# Altium schematic sheet MAX31865-RTD-SPI.SchDoc: USB-RTD Reader
size A4; Revision: 1.0; SheetNumber: 3; SheetTotal: 3; ProjectName: USB - RTD Reader
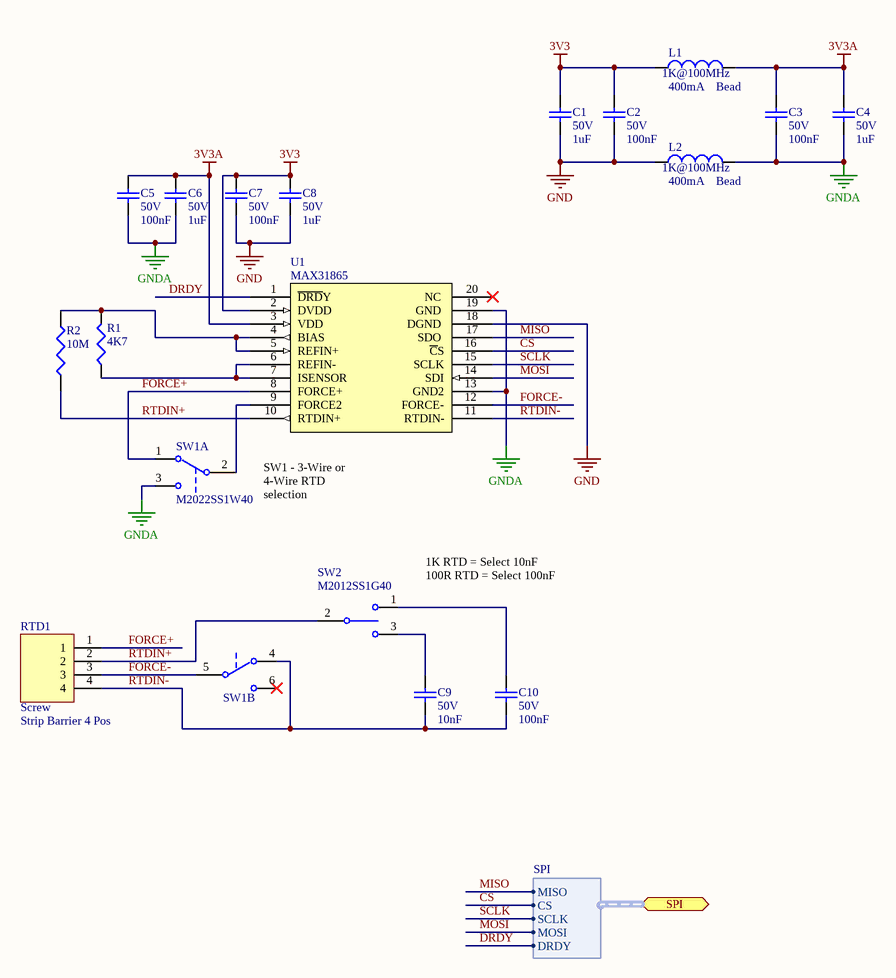
[diagram p0: MAX31865-RTD-SPI.SchDoc]

## Parts
C1  value 1uF  Tensão: 50V  [CC0603]  (hidden comment: Capacitor Cerâmico)
C2  value 100nF  Tensão: 50V  [CC0603]  (hidden comment: Capacitor Cerâmico)
C3  value 100nF  Tensão: 50V  [CC0603]  (hidden comment: Capacitor Cerâmico)
C4  value 1uF  Tensão: 50V  [CC0603]  (hidden comment: Capacitor Cerâmico)
C5  value 100nF  Tensão: 50V  [CC0603]  (hidden comment: Capacitor Cerâmico)
C6  value 1uF  Tensão: 50V  [CC0603]  (hidden comment: Capacitor Cerâmico)
C7  value 100nF  Tensão: 50V  [CC0603]  (hidden comment: Capacitor Cerâmico)
C8  value 1uF  Tensão: 50V  [CC0603]  (hidden comment: Capacitor Cerâmico)
C9  value 10nF  Tensão: 50V  [CC0603]  (hidden comment: Capacitor Cerâmico)
C10  value 100nF  Tensão: 50V  [CC0603]  (hidden comment: Capacitor Cerâmico)
L1  Bead  value 1K@100MHz  Corrente: 400mA  [CC0603]
L2  Bead  value 1K@100MHz  Corrente: 400mA  [CC0603]
R1  value 4K7  [CC0603]  (hidden comment: Resistor)
R2  value 10M  [CC0603]  (hidden comment: Resistor)
RTD1  Screw  value Strip Barrier 4 Pos  [CONN BARRIER STRIP 4CIRC 0.325"]
SW1  M2022SS1W40  [SWITCH TOGGLE DPDT 6A 125V]  (parts A,B of 2)
SW2  M2012SS1G40  [SWITCH TOGGLE SPDT 6A 125V]
U1  MAX31865  [TSSOP-20N]

## Ports
SPI (harness SPI)

## Harnesses
SPI: MISO, CS, SCLK, MOSI, DRDY

## Nets
3V3: C1.2 C2.2 C7.2 C8.2 L1.1 U1.2(DVDD)
3V3A: C3.2 C4.2 C5.2 C6.2 L1.2 U1.3(VDD)
GND: C1.1 C2.1 C7.1 C8.1 L2.1 U1.18(DGND)
GNDA: C3.1 C4.1 C5.1 C6.1 L2.2 SW1.3(NO1) U1.13(GND2) U1.19(GND)
CS: U1.16(~{C}S) ; port SPI.CS
DRDY: U1.1(~{DRD}Y) ; port SPI.DRDY
FORCE+: RTD1.1 SW1.1(NC1) U1.8(FORCE+)
FORCE-: RTD1.3 SW1.5(C2) U1.12(FORCE-)
MISO: U1.17(SDO) ; port SPI.MISO
MOSI: U1.14(SDI) ; port SPI.MOSI
RTDIN+: R2.1 RTD1.2 SW2.2(C1) U1.10(RTDIN+)
RTDIN-: C9.1 C10.1 RTD1.4 SW1.4(NC2) U1.11(RTDIN-)
SCLK: U1.15(SCLK) ; port SPI.SCLK
NetC9_2: C9.2 SW2.3(NO1)
NetC10_2: C10.2 SW2.1(NC1)
NetR1_1: R1.1 U1.6(REFIN-) U1.7(ISENSOR)
NetR1_2: R1.2 R2.2 U1.4(BIAS) U1.5(REFIN+)
NetSW1_2: SW1.2(C1) U1.9(FORCE2)

Not connected (* = marked no-connect by the designer): SW1 6(NO2)*; U1 20(NC)*

## Notes on the sheet
- SW1 - 3-Wire or 4-Wire RTD selection
- (near SW2) 1K RTD = Select 10nF
  100R RTD = Select 100nF
- Projeto:
- Tamanho:
- Data:
- A4
- Eng. Felipe Navarro
- Hora:
- Revisão:
- Folha
- de
- Arquivo:

## Library data of the parts
C1 C4 C6 C8 = Cap 1uF 50V 0603 X5R: Capacitor (Semiconductor SIM Model); Chinês: Local; ChinesePrice: 0,01100; Corrente: *A; Potência: *W; Obs:: X5R; Tolerância: ±10%; Supplier 1: Digi-Key; Supplier Part Number 1: 587-2400-1-ND; ComponentLink1Description: Datasheet; ComponentLink1URL: D:\Tecnoclade\Datasheet\!DataMissing.pdf
C2 C3 C5 C7 C10 = Cap 100nF 50V 0603 X7R: Capacitor (Semiconductor SIM Model); Chinês: Local; ChinesePrice: 0,00250; Corrente: *A; Potência: *W; Obs:: X7R; Tolerância: ±10%; Supplier 1: Digi-Key; Supplier Part Number 1: 1276-1000-1-ND; ComponentLink1Description: Datasheet; ComponentLink1URL: D:\Tecnoclade\Datasheet\!DataMissing.pdf
C9 = Cap 10nF 50V 0603 X7R 5%: Capacitor (Semiconductor SIM Model); Chinês: Local; ChinesePrice: 0,00320; Corrente: *A; Potência: *W; Obs:: X7R; Tolerância: ±5%; Supplier 1: Digi-Key; Supplier Part Number 1: 399-1092-1-ND; ComponentLink1Description: Datasheet; ComponentLink1URL: D:\Tecnoclade\Datasheet\!DataMissing.pdf
L1 L2 = Bd 1K@100MHz 0603 400mA: ChinesePrice: 0,00000; Chinês: -----; Obs:: Ferrite (0R5); Tolerância: ±25%; Potência: *; Supplier 1: Digi-Key; Supplier Part Number 1: 445-1550-1-ND; Tensão: *; ComponentLink1Description: Datasheet; ComponentLink1URL: D:\Tecnoclade\Datasheet\!DataMissing.pdf; Substituição: 27/06/2014
R1 = Res 4K7 1% 0603 1/10W: ChinesePrice: 0,00000; Chinês: ----; Corrente: *A; Potência: 1/10W; Tensão: *V; Obs: ±100ppm/ºC; Tolerância: ±1%; Supplier 1: Digi-Key; Supplier Part Number 1: RMCF0603FT4K70CT-ND; ComponentLink1Description: Datasheet; ComponentLink1URL: D:\Tecnoclade\Datasheet\!DataMissing.pdf
R2 = Res 10M 1% 0603 1/10W: ChinesePrice: 0,00000; Chinês: ----; Corrente: *A; Potência: 1/10W; Tensão: *V; Tolerância: 1*%; Supplier 1: Digi-Key; Supplier Part Number 1: 311-10.0MHRCT-ND; Obs:: *; ComponentLink1Description: Datasheet; ComponentLink1URL: D:\Tecnoclade\Datasheet\!DataMissing.pdf
RTD1 = Screw-4 125V 6A P2.54mm: Conector Screw Block; ChinesePrice: 0,00000; Chinês: ----; Corrente: 6A; Tensão: 125V; Obs:: Through Hole, M1.6; Tolerância: 20-30 AWG; Potência: *; Supplier 1: Digi-Key; Supplier Part Number 1: 1-1437667-0-ND; ComponentLink1Description: Datasheet
SW1 = SW-DPDT: Double-Pole, Double-Throw Switch; ChinesePrice: 1,64000; Chinês: Local; Corrente: 6A; Tensão: 125V; Value: ON-ON; Potência: *; Supplier 1: Digi-Key; Supplier Part Number 1: M2022SS1W40-ND; Obs:: *; Tolerância: *; ComponentLink1Description: Datasheet; ComponentLink1URL: D:\Tecnoclade\Datasheet\
SW2 = SW-SPDT: Corrente: 3A; Tensão: 120V; ChinesePrice: 0,00000; Chinês: -----; Value: On-On; Supplier 1: Digi-Key; Supplier Part Number 1: M2012SS1G40-ND; Potência: *; Obs:: M2012SS1G40; Tolerância: *; ComponentLink1Description: Datasheet; ComponentLink1URL: D:\Tecnoclade\Datasheet\
U1 = MAX31865: RTD-to-Digital Converter; ChinesePrice: 0,00000; Chinês: ----; Supplier 1: Digi-Key; Corrente: *; Potência: *; Tensão: *; Value: *; Obs:: *; Tolerância: *; ComponentLink1Description: Datasheet; ComponentLink1URL: D:\Tecnoclade\Datasheet\